# Altium schematic sheet 36.SchDoc
size A3
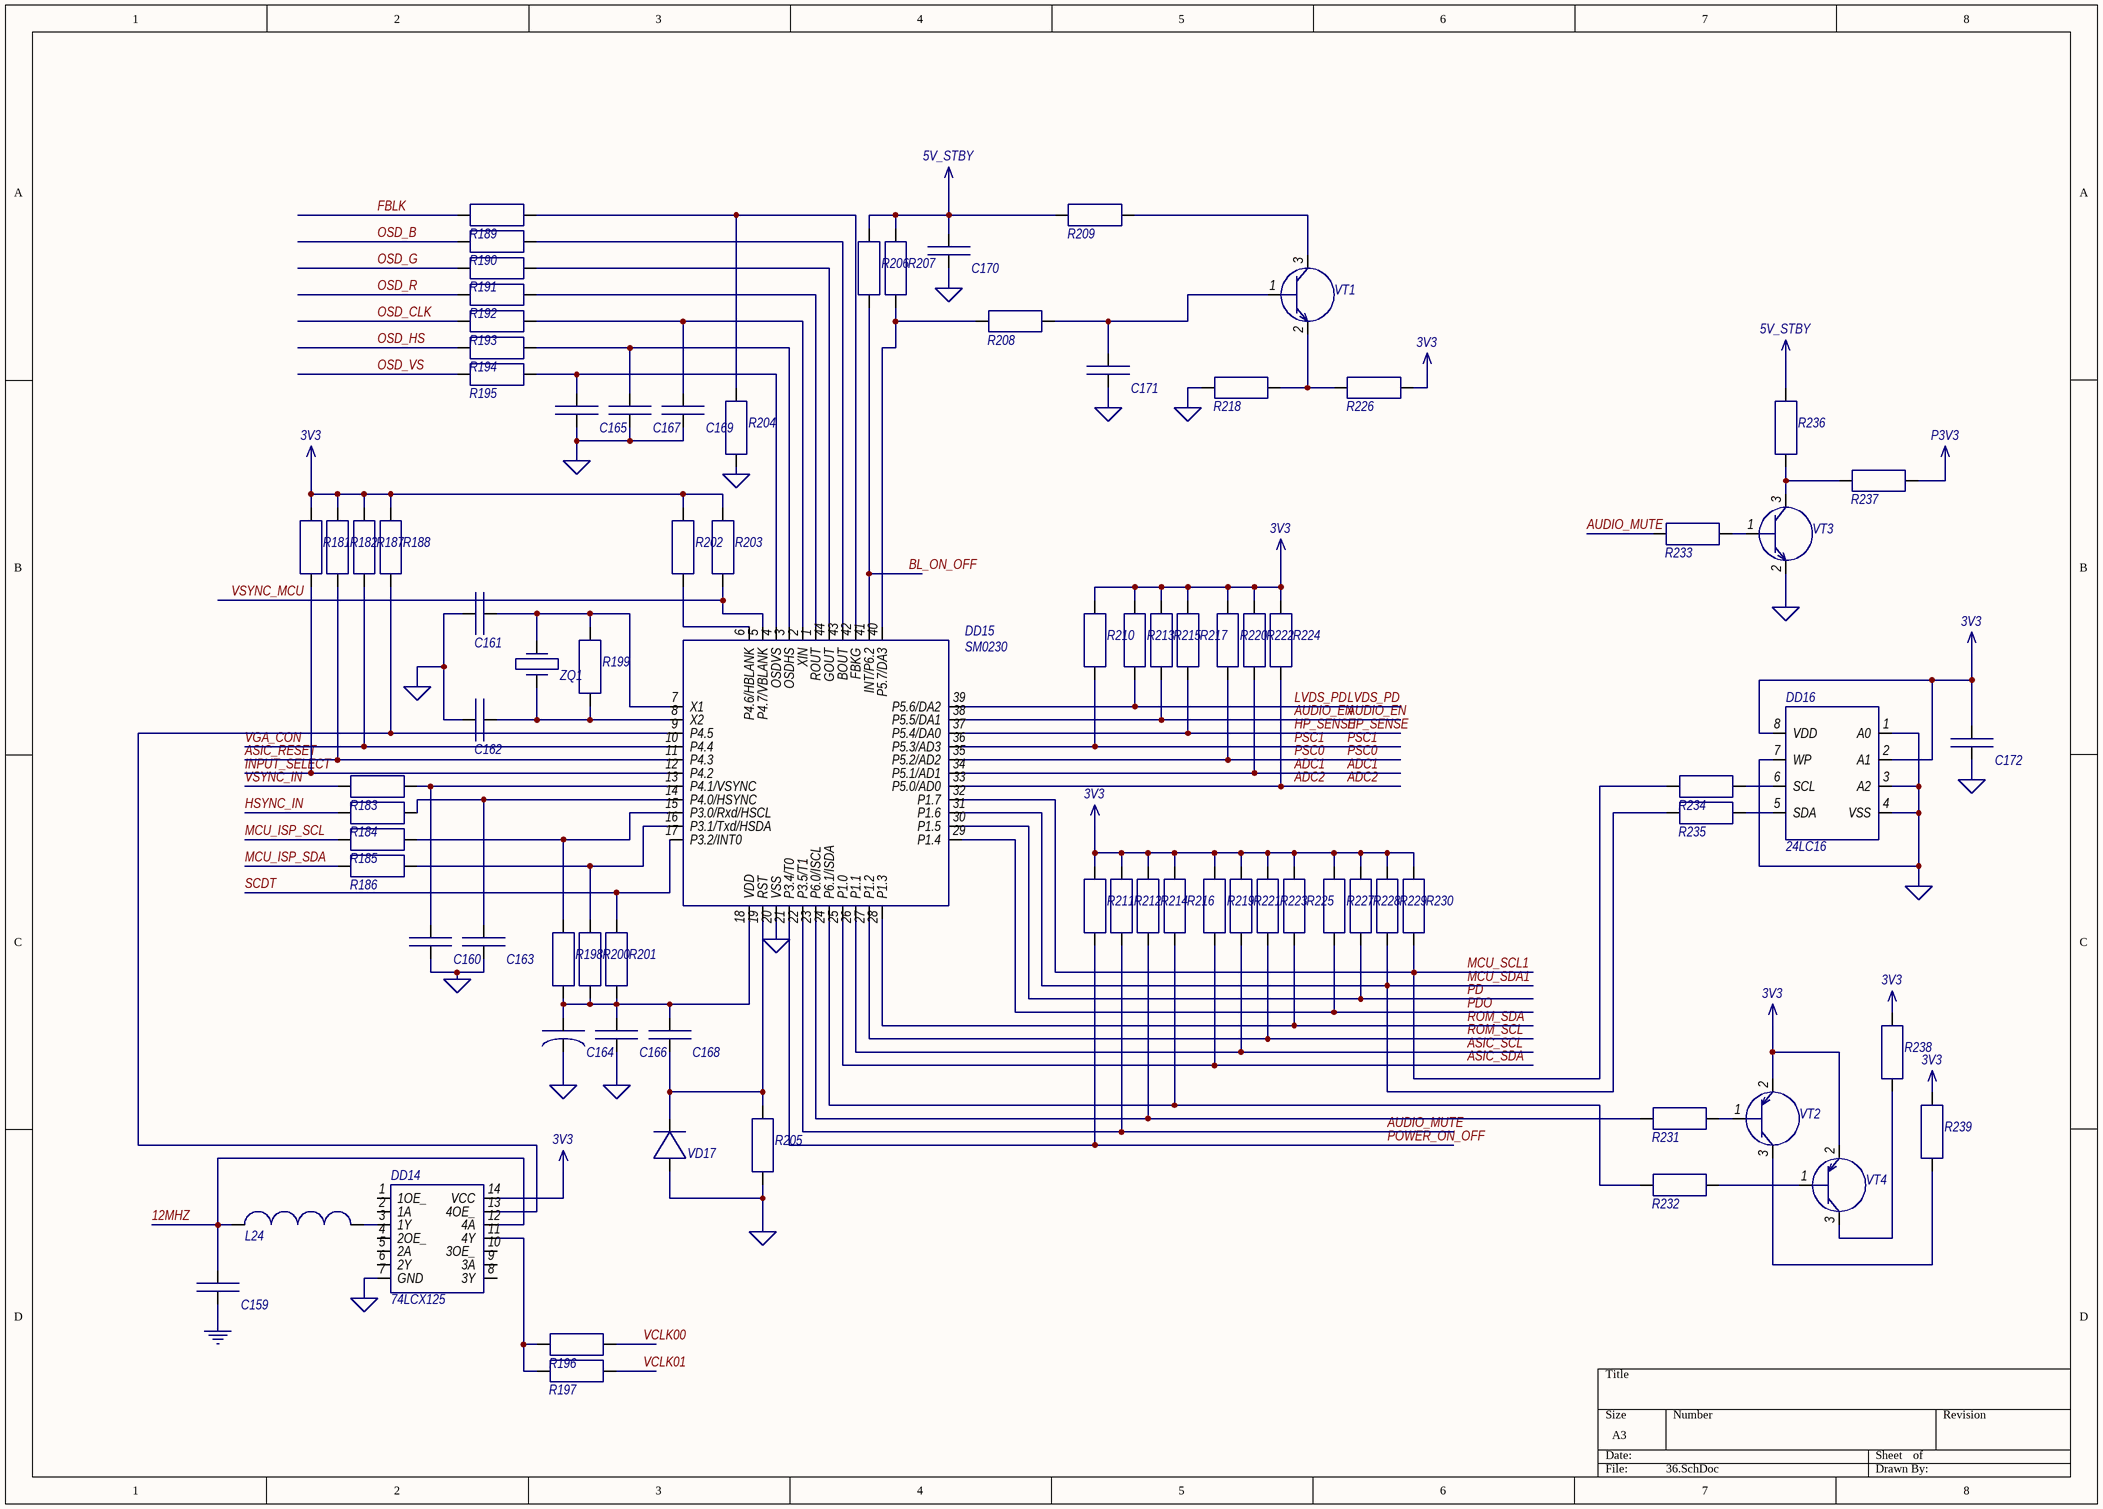
[diagram p0: 36.SchDoc]

## Parts
C159  Capacitor  [cap_electro_13]  (value not drawn)
C160  Capacitor  [cap_electro_13]  (value not drawn)
C161  Capacitor  [cap_electro_13]  (value not drawn)
C162  Capacitor  [cap_electro_13]  (value not drawn)
C163  Capacitor  [cap_electro_13]  (value not drawn)
C164  TuningCapacitor  [Cap_tantal_D]  (value not drawn)
C165  Capacitor  [cap_electro_13]  (value not drawn)
C166  Capacitor  [cap_electro_13]  (value not drawn)
C167  Capacitor  [cap_electro_13]  (value not drawn)
C168  Capacitor  [cap_electro_13]  (value not drawn)
C169  Capacitor  [cap_electro_13]  (value not drawn)
C170  Capacitor  [cap_electro_13]  (value not drawn)
C171  Capacitor  [cap_electro_13]  (value not drawn)
C172  Capacitor  [cap_electro_13]  (value not drawn)
DD14  74LCX125  [74LCX125(page12)]
DD15  SM0230  [SM0230]
DD16  24LC16  [24Cxx]
L24  Inductor  [inductor]  (value not drawn)
R181  Resistor  [R_1206]  (value not drawn)
R182  Resistor  [R_1206]  (value not drawn)
R183  Resistor  [R_1206]  (value not drawn)
R184  Resistor  [R_1206]  (value not drawn)
R185  Resistor  [R_1206]  (value not drawn)
R186  Resistor  [R_1206]  (value not drawn)
R187  Resistor  [R_1206]  (value not drawn)
R188  Resistor  [R_1206]  (value not drawn)
R189  Resistor  [R_1206]  (value not drawn)
R190  Resistor  [R_1206]  (value not drawn)
R191  Resistor  [R_1206]  (value not drawn)
R192  Resistor  [R_1206]  (value not drawn)
R193  Resistor  [R_1206]  (value not drawn)
R194  Resistor  [R_1206]  (value not drawn)
R195  Resistor  [R_1206]  (value not drawn)
R196  Resistor  [R_1206]  (value not drawn)
R197  Resistor  [R_1206]  (value not drawn)
R198  Resistor  [R_1206]  (value not drawn)
R199  Resistor  [R_1206]  (value not drawn)
R200  Resistor  [R_1206]  (value not drawn)
R201  Resistor  [R_1206]  (value not drawn)
R202  Resistor  [R_1206]  (value not drawn)
R203  Resistor  [R_1206]  (value not drawn)
R204  Resistor  [R_1206]  (value not drawn)
R205  Resistor  [R_1206]  (value not drawn)
R206  Resistor  [R_1206]  (value not drawn)
R207  Resistor  [R_1206]  (value not drawn)
R208  Resistor  [R_1206]  (value not drawn)
R209  Resistor  [R_1206]  (value not drawn)
R210  Resistor  [R_1206]  (value not drawn)
R211  Resistor  [R_1206]  (value not drawn)
R212  Resistor  [R_1206]  (value not drawn)
R213  Resistor  [R_1206]  (value not drawn)
R214  Resistor  [R_1206]  (value not drawn)
R215  Resistor  [R_1206]  (value not drawn)
R216  Resistor  [R_1206]  (value not drawn)
R217  Resistor  [R_1206]  (value not drawn)
R218  Resistor  [R_1206]  (value not drawn)
R219  Resistor  [R_1206]  (value not drawn)
R220  Resistor  [R_1206]  (value not drawn)
R221  Resistor  [R_1206]  (value not drawn)
R222  Resistor  [R_1206]  (value not drawn)
R223  Resistor  [R_1206]  (value not drawn)
R224  Resistor  [R_1206]  (value not drawn)
R225  Resistor  [R_1206]  (value not drawn)
R226  Resistor  [R_1206]  (value not drawn)
R227  Resistor  [R_1206]  (value not drawn)
R228  Resistor  [R_1206]  (value not drawn)
R229  Resistor  [R_1206]  (value not drawn)
R230  Resistor  [R_1206]  (value not drawn)
R231  Resistor  [R_1206]  (value not drawn)
R232  Resistor  [R_1206]  (value not drawn)
R233  Resistor  [R_1206]  (value not drawn)
R234  Resistor  [R_1206]  (value not drawn)
R235  Resistor  [R_1206]  (value not drawn)
R236  Resistor  [R_1206]  (value not drawn)
R237  Resistor  [R_1206]  (value not drawn)
R238  Resistor  [R_1206]  (value not drawn)
R239  Resistor  [R_1206]  (value not drawn)
VD17  Diode  [zener_diode]  (value not drawn)
VT1  MMBT3904L  [MMBT3904L]  (value not drawn)
VT2  2N3906  [2N3906]  (value not drawn)
VT3  MMBT3904L  [MMBT3904L]  (value not drawn)
VT4  2N3906  [2N3906]  (value not drawn)
ZQ1  Crystal  [crystal]  (value not drawn)

## Nets
3V3: C172.1 DD14.14(VCC) DD16.2(A1) DD16.8(VDD) R181.2 R182.2 R187.2 R188.2 R202.2 R203.2 R210.1 R211.1 R212.1 R213.1 R214.1 R215.1 R216.1 R217.1 R219.1 R220.1 R221.1 R222.1 R223.1 R224.1 R225.1 R226.2 R227.1 R228.1 R229.1 R230.1 R238.2 R239.2 VT2.2(Emitter) VT4.2(Emitter)
5V_STBY: C170.1 R206.1 R207.1 R209.1 R236.2
GND: C159.2 C160.1 C161.2 C162.2 C163.1 C164.2 C165.2 C166.1 C167.2 C169.2 C170.2 C171.2 C172.2 DD14.7(GND) DD15.20(VSS) DD16.1(A0) DD16.3(A2) DD16.4(VSS) DD16.7(WP) R204.1 R205.1 R218.1 VD17.1 VT3.2(Emitter)
P3V3: R237.2
12MHZ: C159.1 DD14.12(4A) L24.1
ADC1: DD15.34(P5.1/AD1) R222.2
ADC2: DD15.33(P5.0/AD0) R224.2
ASIC_RESET: DD15.11(P4.3) R182.1
ASIC_SCL: DD15.26(P1.1) R221.2
ASIC_SDA: DD15.25(P1.0) R219.2
AUDIO_EN: DD15.38(P5.5/DA1) R215.2
AUDIO_MUTE: DD15.22(P3.5/T1) R212.2 R233.1
BL_ON_OFF: DD15.41(INT/P6.2) R206.2
FBLK: R189.2
HP_SENSE: DD15.37(P5.4/DA0) R217.2
HSYNC_IN: R184.1
INPUT_SELECT: DD15.12(P4.2) R181.1
LVDS_PD: DD15.39(P5.6/DA2) R213.2
MCU_ISP_SCL: R185.1
MCU_ISP_SDA: R186.1
MCU_SCL1: DD15.32(P1.7) R230.2 R234.1
MCU_SDA1: DD15.31(P1.6) R229.2 R235.1
OSD_B: R190.2
OSD_CLK: R193.2
OSD_G: R191.2
OSD_HS: R194.2
OSD_R: R192.2
OSD_VS: R195.2
PD: DD15.30(P1.5) R228.2
PDO: DD15.29(P1.4) R227.2
POWER_ON_OFF: DD15.21(P3.4/T0) R211.2
PSC0: DD15.35(P5.2/AD2) R220.2
PSC1: DD15.36(P5.3/AD3) R210.2
ROM_SCL: DD15.27(P1.2) R223.2
ROM_SDA: DD15.28(P1.3) R225.2
SCDT: DD15.17(P3.2/INT0) R201.2
VCLK00: R196.2
VCLK01: R197.2
VGA_CON: DD15.10(P4.4) R187.1
VSYNC_IN: R183.1
VSYNC_MCU: DD15.5(P4.7/VBLANK) R203.1
NetC160_2: C160.2 DD15.13(P4.1/VSYNC) R183.2
NetC161_1: C161.1 DD15.7(X1) R199.2 ZQ1.2
NetC162_1: C162.1 DD15.8(X2) R199.1 ZQ1.1
NetC163_2: C163.2 DD15.14(P4.0/HSYNC) R184.2
NetC164_1: C164.1 C166.2 C168.2 DD15.18(VDD) R198.1 R200.1 R201.1
NetC165_1: C165.1 DD15.4(OSDVS) R195.1
NetC167_1: C167.1 DD15.3(OSDHS) R194.1
NetC168_1: C168.1 DD15.19(RST) R205.2 VD17.2
NetC169_1: C169.1 DD15.2(XIN) R193.1
NetC171_1: C171.1 R208.2 VT1.1(Base)
NetDD14_3: DD14.3(1Y) L24.2
NetDD14_11: DD14.11(4Y) R196.1 R197.1
NetDD14_13: DD14.13(4OE_) DD15.9(P4.5) R188.1
NetDD15_1: DD15.1(ROUT) R192.1
NetDD15_6: DD15.6(P4.6/HBLANK) R202.1
NetDD15_15: DD15.15(P3.0/Rxd/HSCL) R185.2 R198.2
NetDD15_16: DD15.16(P3.1/Txd/HSDA) R186.2 R200.2
NetDD15_23: DD15.23(P6.0/ISCL) R214.2 R231.1
NetDD15_24: DD15.24(P6.1/ISDA) R216.2 R232.1
NetDD15_40: DD15.40(P5.7/DA3) R207.2 R208.1
NetDD15_42: DD15.42(FBKG) R189.1 R204.2
NetDD15_43: DD15.43(BOUT) R190.1
NetDD15_44: DD15.44(GOUT) R191.1
NetDD16_5: DD16.5(SDA) R235.2
NetDD16_6: DD16.6(SCL) R234.2
NetR209_2: R209.2 VT1.3(Collector)
NetR218_2: R218.2 R226.1 VT1.2(Emitter)
NetR231_2: R231.2 VT2.1(Base)
NetR232_2: R232.2 VT4.1(Base)
NetR233_2: R233.2 VT3.1(Base)
NetR236_1: R236.1 R237.1 VT3.3(Collector)
NetR238_1: R238.1 VT4.3(Collector)
NetR239_1: R239.1 VT2.3(Collector)

Not connected (* = marked no-connect by the designer): DD14 1(1OE_) 2(1A) 4(2OE_) 5(2A) 6(2Y) 8(3Y) 9(3A) 10(3OE_)